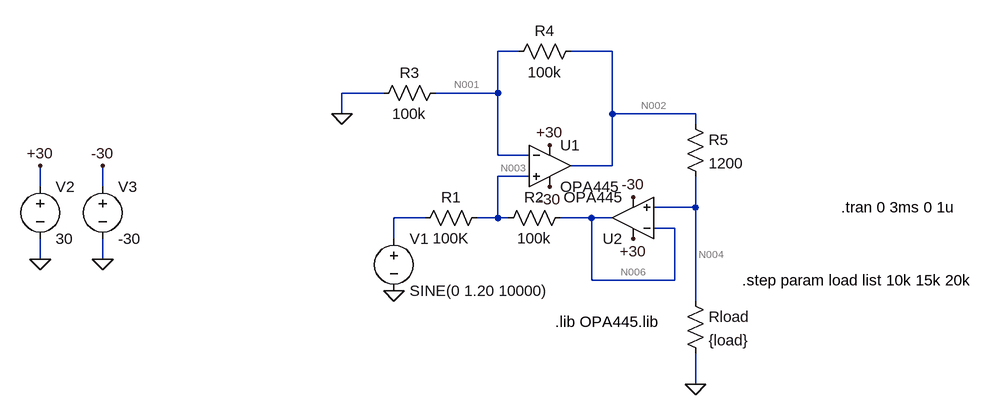
[diagram p0: schematic SP26_brainstim3_improvedHowlandPump_BenFerguson.asc]
SP26_brainstim3_improvedHowlandPump_BenFerguson.asc, the LTspice schematic file:
Version 4
SHEET 1 880 680
WIRE 144 -64 112 -64
WIRE 288 -64 224 -64
WIRE -64 0 -128 0
WIRE 112 0 112 -64
WIRE 112 0 16 0
WIRE -128 32 -128 0
WIRE 288 32 288 -64
WIRE 416 32 288 32
WIRE 416 48 416 32
WIRE 112 96 112 0
WIRE 160 96 112 96
WIRE 288 112 288 32
WIRE 288 112 224 112
WIRE 160 128 112 128
WIRE -592 144 -592 112
WIRE -496 144 -496 112
WIRE 416 176 416 128
WIRE 416 176 352 176
WIRE 0 192 -48 192
WIRE 112 192 112 128
WIRE 112 192 80 192
WIRE 128 192 112 192
WIRE 256 192 208 192
WIRE 288 192 256 192
WIRE 384 208 352 208
WIRE -48 224 -48 192
WIRE -592 256 -592 224
WIRE -496 256 -496 224
WIRE 256 288 256 192
WIRE 384 288 384 208
WIRE 384 288 256 288
WIRE 416 320 416 176
WIRE 416 448 416 400
FLAG -592 256 0
FLAG -496 256 0
FLAG -592 112 +30
FLAG -496 112 -30
FLAG 192 80 +30
FLAG 320 224 +30
FLAG 192 144 -30
FLAG 320 160 -30
FLAG -128 32 0
FLAG 416 448 0
FLAG -48 304 0
SYMBOL OpAmps\\opamp2 192 48 R0
SYMATTR InstName U1
SYMATTR Value OPA445
SYMBOL voltage -48 208 R0
WINDOW 123 0 0 Left 0
WINDOW 39 0 0 Left 0
SYMATTR InstName V1
SYMATTR Value SINE(0 1.20 10000)
SYMBOL res 96 176 R90
WINDOW 0 0 56 VBottom 2
WINDOW 3 32 56 VTop 2
SYMATTR InstName R1
SYMATTR Value 100K
SYMBOL res 224 176 R90
WINDOW 0 0 56 VBottom 2
WINDOW 3 32 56 VTop 2
SYMATTR InstName R2
SYMATTR Value 100k
SYMBOL OpAmps\\opamp2 320 256 R180
SYMATTR InstName U2
SYMATTR Value OPA445
SYMBOL voltage -592 128 R0
SYMATTR InstName V2
SYMATTR Value 30
SYMBOL voltage -496 128 R0
SYMATTR InstName V3
SYMATTR Value -30
SYMBOL res 32 -16 R90
WINDOW 0 0 56 VBottom 2
WINDOW 3 32 56 VTop 2
SYMATTR InstName R3
SYMATTR Value 100k
SYMBOL res 240 -80 R90
WINDOW 0 0 56 VBottom 2
WINDOW 3 32 56 VTop 2
SYMATTR InstName R4
SYMATTR Value 100k
SYMBOL res 400 32 R0
SYMATTR InstName R5
SYMATTR Value 1200
SYMBOL res 400 304 R0
SYMATTR InstName Rload
SYMATTR Value {load}
TEXT 200 352 Left 2 !.lib OPA445.lib
TEXT 640 176 Left 2 !.tran 0 3ms 0 1u
TEXT 488 288 Left 2 !.step param load list 10k 15k 20k

The netlist it stands for:
* SP26_brainstim3_improvedHowlandPump_BenFerguson.asc
XU1 N003 N001 +30 -30 N002 OPA445  ; pins In+ In- V+ V- OUT
V1 N005 0 SINE(0 1.20 10000)
R1 N003 N005 100K
R2 N006 N003 100k
XU2 N004 N006 +30 -30 N006 OPA445  ; pins In+ In- V+ V- OUT
V2 +30 0 30
V3 -30 0 -30
R3 N001 0 100k
R4 N002 N001 100k
R5 N002 N004 1200
Rload N004 0 {load}
.lib OPA445.lib
.tran 0 3ms 0 1u
.step param load list 10k 15k 20k
.backanno
.end

* Results of the author's LTspice run, read from the files saved beside the schematic
* Operating Point (first step), zero values left out:
*   load = 10 k
*   V(n002) = -35.04 µV
*   V(-30) = -30 V
*   V(+30) = 30 V
*   V(n001) = -8.249 µV
*   V(n003) = -6.931 µV
*   V(n006) = -32.41 µV
*   V(n004) = -31.09 µV
*   I(R1) = -69.31 pA
*   I(R2) = -254.7 pA
*   I(R3) = -82.49 pA
*   I(R4) = -267.9 pA
*   I(R5) = -3.294 nA
*   I(Rload) = -3.109 nA
*   I(V1) = -69.31 pA
*   I(V2) = -7.195 mA
*   I(V3) = 7.195 mA
*   Ix(u1:1) = -185.4 pA
*   Ix(u1:2) = -185.4 pA
*   Ix(u1:3) = 3.598 mA
*   Ix(u1:4) = -3.597 mA
*   Ix(u1:5) = 3.562 nA
*   Ix(u2:1) = -185.4 pA
*   Ix(u2:2) = -185.4 pA
*   Ix(u2:3) = 3.598 mA
*   Ix(u2:4) = -3.597 mA
*   Ix(u2:5) = 440.2 pA
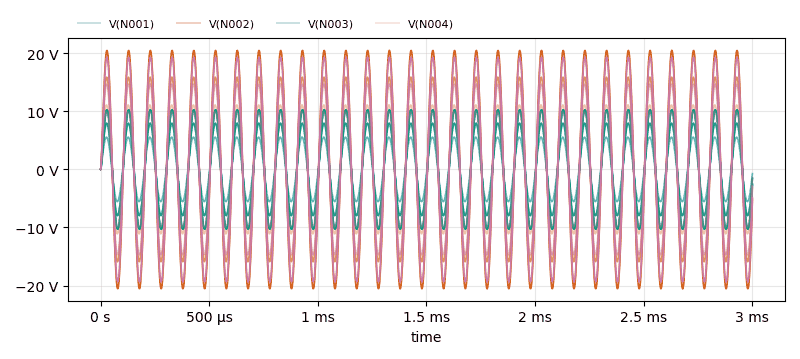
[diagram p1: Transient Analysis of SP26_brainstim3_improvedHowlandPump_BenFerguson.asc, plotted from the saved traces]
* Transient Analysis, 3 runs:
*   V(N001) [load=10000]: min -5.549 V, max 5.542 V, average 525.5 µV, rms 3.922 V, last -772.9 mV
*   V(N001) [load=15000]: min -7.951 V, max 7.935 V, average 1.586 mV, rms 5.617 V, last -1.581 V
*   V(N001) [load=20000]: min -10.27 V, max 10.24 V, average 3.505 mV, rms 7.252 V, last -2.626 V
*   V(N002) [load=10000]: min -11.1 V, max 11.09 V, average 984.1 µV, rms 7.845 V, last -1.494 V
*   V(N002) [load=15000]: min -15.9 V, max 15.87 V, average 3.056 mV, rms 11.23 V, last -3.088 V
*   V(N002) [load=20000]: min -20.55 V, max 20.48 V, average 6.829 mV, rms 14.5 V, last -5.158 V
*   V(N003) [load=10000]: min -5.549 V, max 5.544 V, average 487 µV, rms 3.922 V, last -717.9 mV
*   V(N003) [load=15000]: min -7.951 V, max 7.937 V, average 1.506 mV, rms 5.617 V, last -1.503 V
*   V(N003) [load=20000]: min -10.27 V, max 10.24 V, average 3.371 mV, rms 7.252 V, last -2.527 V
*   V(N004) [load=10000]: min -9.91 V, max 9.899 V, average 879.6 µV, rms 7.004 V, last -1.335 V
*   V(N004) [load=15000]: min -14.73 V, max 14.7 V, average 2.831 mV, rms 10.4 V, last -2.861 V
*   V(N004) [load=20000]: min -19.39 V, max 19.32 V, average 6.446 mV, rms 13.68 V, last -4.868 V